# Altium schematic sheet STM32-Nucleo-144_U575ZI-Q.SchDoc: STM32 Nucleo-144 U575ZI-Q Headers
size 431 x 279 mm; DocumentNumber: 17; SheetNumber: 17; SheetTotal: 18; ENG_APP_DATE: --/--/--; DSN_APP_DATE: --/--/--; CHK_APP_DATE: --/--/--
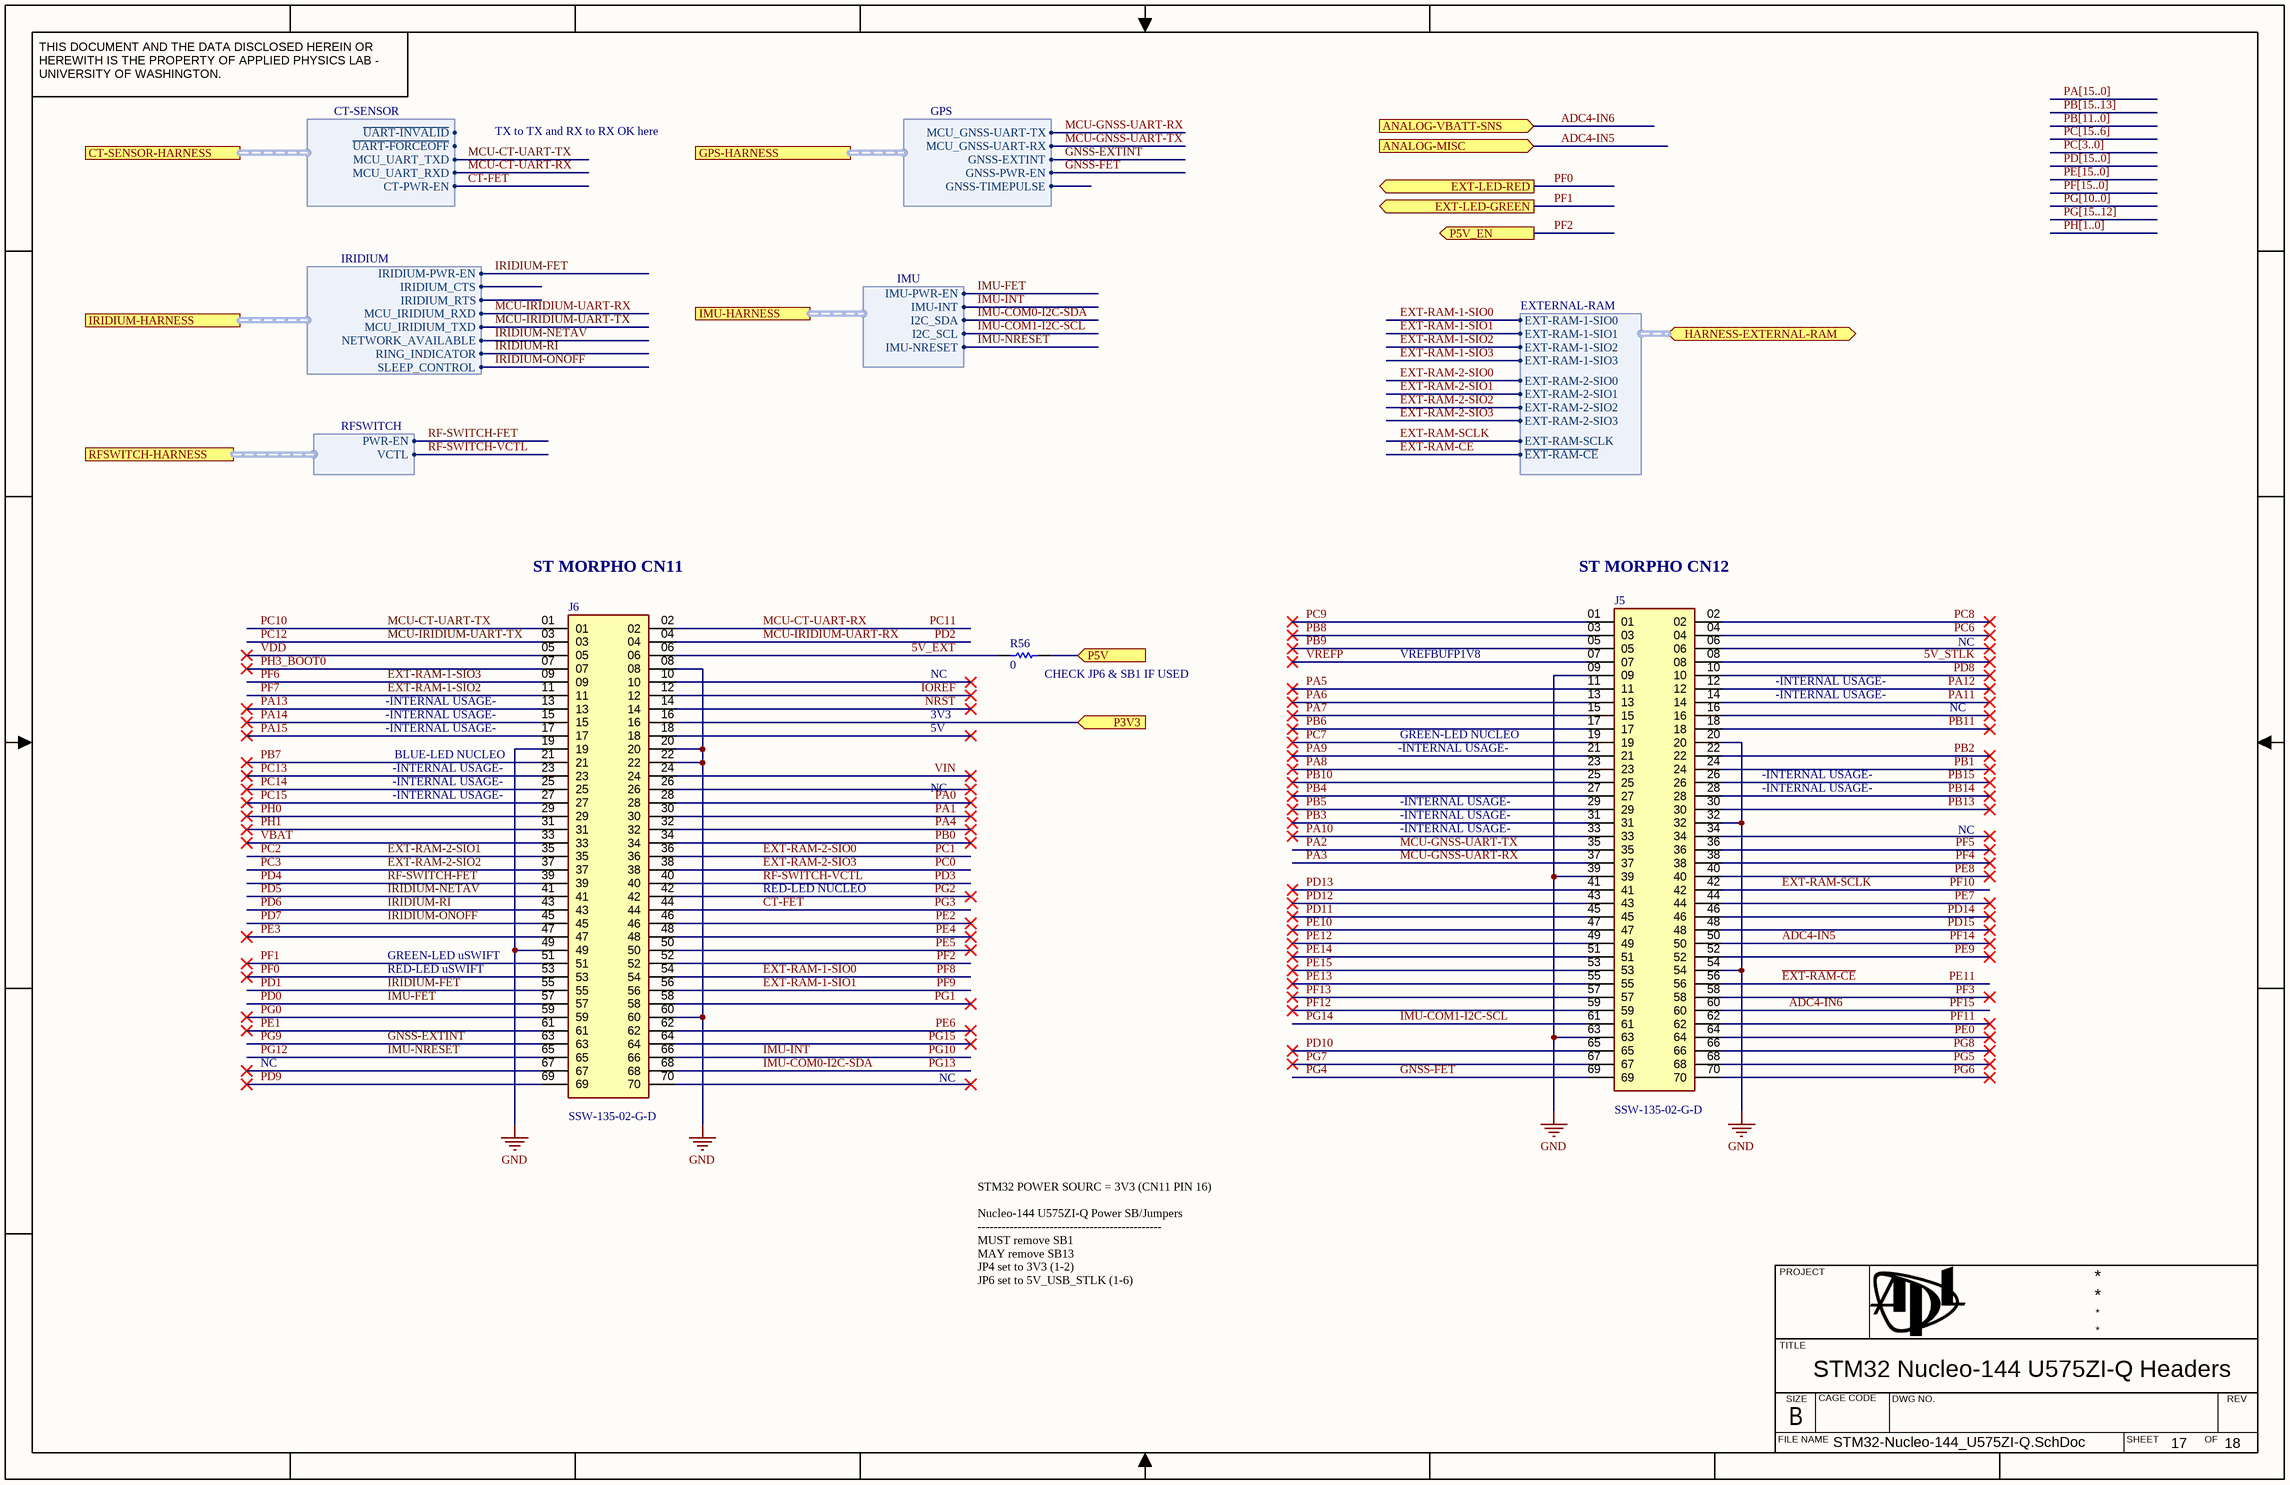
[diagram p0: STM32-Nucleo-144_U575ZI-Q.SchDoc]

## Parts
J5  SSW-135-02-G-D  [SAMTEC_SSW-135-02-G-D]
J6  SSW-135-02-G-D  [SAMTEC_SSW-135-02-G-D]
R56  value 0  [RESC2013X50X35ML15T15]  (hidden comment: Resistor 0R +/- 1% 0805 125 mW)

## Ports
ANALOG-MISC (in), ANALOG-VBATT-SNS (in), CT-SENSOR-HARNESS (harness CT-SENSOR), EXT-LED-GREEN (out), EXT-LED-RED (out), GPS-HARNESS (harness GPS), HARNESS-EXTERNAL-RAM (bidir, harness EXTERNAL-RAM), IMU-HARNESS (harness IMU), IRIDIUM-HARNESS (harness IRIDIUM), P3V3 (in), P5V (in), P5V_EN (out), RFSWITCH-HARNESS (harness RFSWITCH)

## Harnesses
CT-SENSOR: MCU_UART_RXD, MCU_UART_TXD, ~{UART-FORCEOFF}, ~{UART-INVALID}, CT-PWR-EN
GPS: MCU_GNSS-UART-RX, MCU_GNSS-UART-TX, GNSS-EXTINT, GNSS-PWR-EN, GNSS-TIMEPULSE
IRIDIUM: SLEEP_CONTROL, RING_INDICATOR, NETWORK_AVAILABLE, MCU_IRIDIUM_TXD, MCU_IRIDIUM_RXD, IRIDIUM_RTS, IRIDIUM_CTS, IRIDIUM-PWR-EN
IMU: I2C_SCL, I2C_SDA, IMU-INT, IMU-PWR-EN, IMU-NRESET
RFSWITCH: VCTL, PWR-EN
EXTERNAL-RAM: EXT-RAM-1-SIO0, EXT-RAM-1-SIO1, EXT-RAM-1-SIO2, EXT-RAM-1-SIO3, EXT-RAM-2-SIO0, EXT-RAM-2-SIO1, EXT-RAM-2-SIO2, EXT-RAM-2-SIO3, EXT-RAM-SCLK, ~{EXT-RAM-CE}

## Nets
GND: J5.09 J5.20 J5.32 J5.39 J5.54 J5.63 J6.08 J6.19 J6.20 J6.22 J6.49 J6.60
5V_EXT: J6.06 R56.2
5V_STLK: J5.08
~{EXT-RAM-CE}: J5.56 ; port HARNESS-EXTERNAL-RAM.~{EXT-RAM-CE}  [also labelled PE11]
ADC4-IN5: J5.50 ; port ANALOG-MISC  [also labelled PF14]
ADC4-IN6: J5.60 ; port ANALOG-VBATT-SNS  [also labelled PF15]
CT-FET: J6.44 ; port CT-SENSOR-HARNESS.CT-PWR-EN  [also labelled PG3]
EXT-RAM-1-SIO0: J6.54 ; port HARNESS-EXTERNAL-RAM.EXT-RAM-1-SIO0  [also labelled PF8]
EXT-RAM-1-SIO1: J6.56 ; port HARNESS-EXTERNAL-RAM.EXT-RAM-1-SIO1  [also labelled PF9]
EXT-RAM-1-SIO2: J6.11 ; port HARNESS-EXTERNAL-RAM.EXT-RAM-1-SIO2  [also labelled PF7]
EXT-RAM-1-SIO3: J6.09 ; port HARNESS-EXTERNAL-RAM.EXT-RAM-1-SIO3  [also labelled PF6]
EXT-RAM-2-SIO0: J6.36 ; port HARNESS-EXTERNAL-RAM.EXT-RAM-2-SIO0  [also labelled PC1]
EXT-RAM-2-SIO1: J6.35 ; port HARNESS-EXTERNAL-RAM.EXT-RAM-2-SIO1  [also labelled PC2]
EXT-RAM-2-SIO2: J6.37 ; port HARNESS-EXTERNAL-RAM.EXT-RAM-2-SIO2  [also labelled PC3]
EXT-RAM-2-SIO3: J6.38 ; port HARNESS-EXTERNAL-RAM.EXT-RAM-2-SIO3  [also labelled PC0]
EXT-RAM-SCLK: J5.42 ; port HARNESS-EXTERNAL-RAM.EXT-RAM-SCLK  [also labelled PF10]
GNSS-EXTINT: J6.63 ; port GPS-HARNESS.GNSS-EXTINT  [also labelled PG9]
GNSS-FET: J5.69 ; port GPS-HARNESS.GNSS-PWR-EN  [also labelled PG4]
IMU-COM0-I2C-SDA: J6.68 ; port IMU-HARNESS.I2C_SDA  [also labelled PG13]
IMU-COM1-I2C-SCL: J5.61 ; port IMU-HARNESS.I2C_SCL  [also labelled PG14]
IMU-FET: J6.57 ; port IMU-HARNESS.IMU-PWR-EN  [also labelled PD0]
IMU-INT: J6.66 ; port IMU-HARNESS.IMU-INT  [also labelled PG10]
IMU-NRESET: J6.65 ; port IMU-HARNESS.IMU-NRESET  [also labelled PG12]
IOREF: J6.12
IRIDIUM-FET: J6.55 ; port IRIDIUM-HARNESS.IRIDIUM-PWR-EN  [also labelled PD1]
IRIDIUM-NETAV: J6.41 ; port IRIDIUM-HARNESS.NETWORK_AVAILABLE  [also labelled PD5]
IRIDIUM-ONOFF: J6.45 ; port IRIDIUM-HARNESS.SLEEP_CONTROL  [also labelled PD7]
IRIDIUM-RI: J6.43 ; port IRIDIUM-HARNESS.RING_INDICATOR  [also labelled PD6]
MCU-CT-UART-RX: J6.02 ; port CT-SENSOR-HARNESS.MCU_UART_RXD  [also labelled PC11]
MCU-CT-UART-TX: J6.01 ; port CT-SENSOR-HARNESS.MCU_UART_TXD  [also labelled PC10]
MCU-GNSS-UART-RX: J5.37 ; port GPS-HARNESS.MCU_GNSS-UART-TX  [also labelled PA3]
MCU-GNSS-UART-TX: J5.35 ; port GPS-HARNESS.MCU_GNSS-UART-RX  [also labelled PA2]
MCU-IRIDIUM-UART-RX: J6.04 ; port IRIDIUM-HARNESS.MCU_IRIDIUM_RXD  [also labelled PD2]
MCU-IRIDIUM-UART-TX: J6.03 ; port IRIDIUM-HARNESS.MCU_IRIDIUM_TXD  [also labelled PC12]
NRST: J6.14
P3V3: J6.16 ; port P3V3
P5V: R56.1 ; port P5V
PA0: J6.28
PA1: J6.30
PA4: J6.32
PA5: J5.11
PA6: J5.13
PA7: J5.15
PA8: J5.23
PA9: J5.21
PA10: J5.33
PA11: J5.14
PA12: J5.12
PA13: J6.13
PA14: J6.15
PA15: J6.17
PB0: J6.34
PB1: J5.24
PB2: J5.22
PB3: J5.31
PB4: J5.27
PB5: J5.29
PB6: J5.17
PB7: J6.21
PB8: J5.03
PB9: J5.05
PB10: J5.25
PB11: J5.18
PB13: J5.30
PB14: J5.28
PB15: J5.26
PC6: J5.04
PC7: J5.19
PC8: J5.02
PC9: J5.01
PC13: J6.23
PC14: J6.25
PC15: J6.27
PD3: J6.40 ; port RFSWITCH-HARNESS.VCTL  [also labelled RF-SWITCH-VCTL]
PD4: J6.39 ; port RFSWITCH-HARNESS.PWR-EN  [also labelled RF-SWITCH-FET]
PD8: J5.10
PD9: J6.69
PD10: J5.65
PD11: J5.45
PD12: J5.43
PD13: J5.41
PD14: J5.46
PD15: J5.48
PE0: J5.64
PE1: J6.61
PE2: J6.46
PE3: J6.47
PE4: J6.48
PE5: J6.50
PE6: J6.62
PE7: J5.44
PE8: J5.40
PE9: J5.52
PE10: J5.47
PE12: J5.49
PE13: J5.55
PE14: J5.51
PE15: J5.53
PF0: J6.53 ; port EXT-LED-RED
PF1: J6.51 ; port EXT-LED-GREEN
PF2: J6.52 ; port P5V_EN
PF3: J5.58
PF4: J5.38
PF5: J5.36
PF11: J5.62
PF12: J5.59
PF13: J5.57
PG0: J6.59
PG1: J6.58
PG2: J6.42
PG5: J5.68
PG6: J5.70
PG7: J5.67
PG8: J5.66
PG15: J6.64
PH0: J6.29
PH1: J6.31
PH3_BOOT0: J6.07
VBAT: J6.33
VDD: J6.05
VIN: J6.24
VREFP: J5.07

Not connected (* = marked no-connect by the designer): J5 06* 16* 34*; J6 10* 18* 26* 67* 70*

## Buses and harness runs
bus PA[15..0]
bus PB[11..0]
bus PB[15..13]
bus PC[3..0]
bus PC[15..6]
bus PD[15..0]
bus PE[15..0]
bus PF[15..0]
bus PG[10..0]
bus PG[15..12]
bus PH[1..0]

## Notes on the sheet
- TX to TX and RX to RX OK here
- ST MORPHO CN11
- (near J5) ST MORPHO CN12
- -INTERNAL USAGE-
- NC
- (near R56) CHECK JP6 & SB1 IF USED
- VREFBUFP1V8
- BLUE-LED NUCLEO
- 3V3
- 5V
- GREEN-LED NUCLEO
- RED-LED NUCLEO
- GREEN-LED uSWIFT
- RED-LED uSWIFT
- STM32 POWER SOURC = 3V3 (CN11 PIN 16)
  Nucleo-144 U575ZI-Q Power SB/Jumpers
  ----------------------------------------------
  MUST remove SB1
  MAY remove SB13
  JP4 set to 3V3 (1-2)
  JP6 set to 5V_USB_STLK (1-6)
- THIS DOCUMENT AND THE DATA DISCLOSED HEREIN OR HEREWITH IS THE PROPERTY OF APPLIED PHYSICS LAB - UNIVERSITY OF WASHINGTON.
- PROJECT
- TITLE
- FILE NAME
- SIZE
- B
- CAGE CODE
- DWG NO.
- SHEET
- OF
- REV

## Library data of the parts
J5 J6 = CMP-002-00123-8: Tiger Buy™ Socket Strip with PCB Tails, 0.100" Pitch; Manufacturer: Samtec; Connector Type: Header; Pitch: 2.54mm; Current Rating: 5.7A; Number of Positions: 70; Max Voltage Rating (AC): 550V; Orientation: Vertical; Gender: Socket; Contact Plating: Gold; Case/Package: Header; Mount: Through Hole; Series: SSW; Min Operating Temperature: -55°C; Max Operating Temperature: 125°C; Number of Rows: 2
R56 = CMP-009-00001-8: Chip Resistor, 0 Ohm, +/- 1%, 125 mW, -55 to 155 degC, 0805 (2012 Metric); Voltage Rating: 150V; Power: 125mW; Decade: 0; RoHS Compliant: True; Min Operating Temperature: -55°C; Pins: 2; Max Operating Temperature: 155°C; Tolerance: 1%; Case/Package: 0805; Mount: Surface Mount